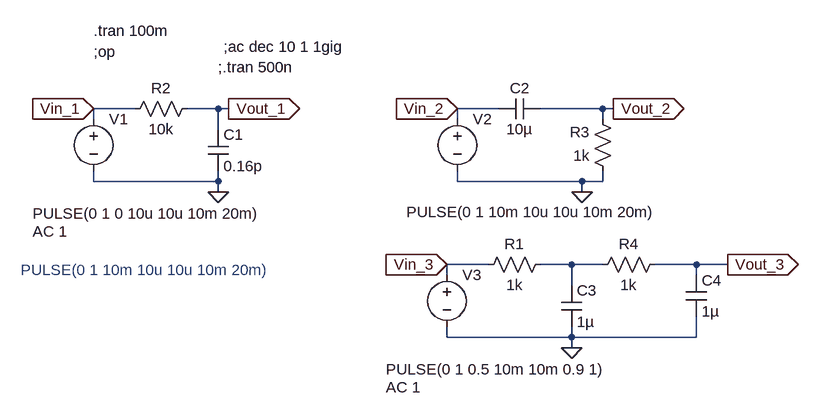
[diagram p0: schematic Delay_cell_1.asc]
Delay_cell_1.asc, the LTspice schematic file:
Version 4
SHEET 1 1056 680
WIRE -96 112 -160 112
WIRE 32 112 -16 112
WIRE 48 112 32 112
WIRE 464 112 400 112
WIRE 624 112 528 112
WIRE 640 112 624 112
WIRE -160 128 -160 112
WIRE 400 128 400 112
WIRE 624 128 624 112
WIRE 32 144 32 112
WIRE -160 224 -160 208
WIRE 32 224 32 208
WIRE 32 224 -160 224
WIRE 400 224 400 208
WIRE 592 224 400 224
WIRE 624 224 624 208
WIRE 624 224 592 224
WIRE 32 240 32 224
WIRE 592 240 592 224
WIRE 448 352 384 352
WIRE 576 352 528 352
WIRE 624 352 576 352
WIRE 768 352 704 352
WIRE 816 352 768 352
WIRE 384 368 384 352
WIRE 768 368 768 352
WIRE 576 384 576 352
WIRE 384 464 384 448
WIRE 576 464 576 448
WIRE 576 464 384 464
WIRE 768 464 768 432
WIRE 768 464 576 464
WIRE 576 480 576 464
FLAG 48 112 Vout_1
IOPIN 48 112 Out
FLAG 32 240 0
FLAG 640 112 Vout_2
IOPIN 640 112 Out
FLAG 592 240 0
FLAG -160 112 Vin_1
IOPIN -160 112 In
FLAG 400 112 Vin_2
IOPIN 400 112 In
FLAG 816 352 Vout_3
IOPIN 816 352 Out
FLAG 576 480 0
FLAG 384 352 Vin_3
IOPIN 384 352 In
SYMBOL cap 16 144 R0
SYMATTR InstName C1
SYMATTR Value 0.16p
SYMBOL res 0 96 R90
WINDOW 0 0 56 VBottom 2
WINDOW 3 32 56 VTop 2
SYMATTR InstName R2
SYMATTR Value 10k
SYMBOL voltage -160 112 R0
WINDOW 3 -94 161 Left 2
WINDOW 123 -94 189 Left 2
WINDOW 39 0 0 Left 0
SYMATTR Value PULSE(0 1 0 10u 10u 10m 20m)
SYMATTR Value2 AC 1
SYMATTR InstName V1
SYMBOL voltage 400 112 R0
WINDOW 3 -78 159 Left 2
WINDOW 123 0 0 Left 0
WINDOW 39 0 0 Left 0
SYMATTR Value PULSE(0 1 10m 10u 10u 10m 20m)
SYMATTR InstName V2
SYMBOL res 640 224 R180
WINDOW 0 36 76 Left 2
WINDOW 3 36 40 Left 2
SYMATTR InstName R3
SYMATTR Value 1k
SYMBOL cap 528 96 R90
WINDOW 0 0 32 VBottom 2
WINDOW 3 32 32 VTop 2
SYMATTR InstName C2
SYMATTR Value 10µ
SYMBOL cap 560 384 R0
SYMATTR InstName C3
SYMATTR Value 1µ
SYMBOL res 544 336 R90
WINDOW 0 0 56 VBottom 2
WINDOW 3 32 56 VTop 2
SYMATTR InstName R1
SYMATTR Value 1k
SYMBOL voltage 384 352 R0
WINDOW 3 -94 161 Left 2
WINDOW 123 -94 189 Left 2
WINDOW 39 0 0 Left 0
SYMATTR Value PULSE(0 1 0.5 10m 10m 0.9 1)
SYMATTR Value2 AC 1
SYMATTR InstName V3
SYMBOL res 720 336 R90
WINDOW 0 0 56 VBottom 2
WINDOW 3 32 56 VTop 2
SYMATTR InstName R4
SYMATTR Value 1k
SYMBOL cap 752 368 R0
SYMATTR InstName C4
SYMATTR Value 1µ
TEXT -160 24 Left 2 !;op
TEXT -160 -8 Left 2 !.tran 100m
TEXT -272 360 Left 2 ;PULSE(0 1 10m 10u 10u 10m 20m)
TEXT 40 16 Left 2 !;ac dec 10 1 1gig
TEXT 32 48 Left 2 !;.tran 500n

The netlist it stands for:
* Delay_cell_1.asc
C1 Vout_1 0 0.16p
R2 Vout_1 Vin_1 10k
V1 Vin_1 0 PULSE(0 1 0 10u 10u 10m 20m) AC 1
V2 Vin_2 0 PULSE(0 1 10m 10u 10u 10m 20m)
R3 0 Vout_2 1k
C2 Vout_2 Vin_2 10µ
C3 N001 0 1µ
R1 N001 Vin_3 1k
V3 Vin_3 0 PULSE(0 1 0.5 10m 10m 0.9 1) AC 1
R4 Vout_3 N001 1k
C4 Vout_3 0 1µ
;op
.tran 100m
* PULSE(0 1 10m 10u 10u 10m 20m)
;ac dec 10 1 1gig
;.tran 500n
.backanno
.end